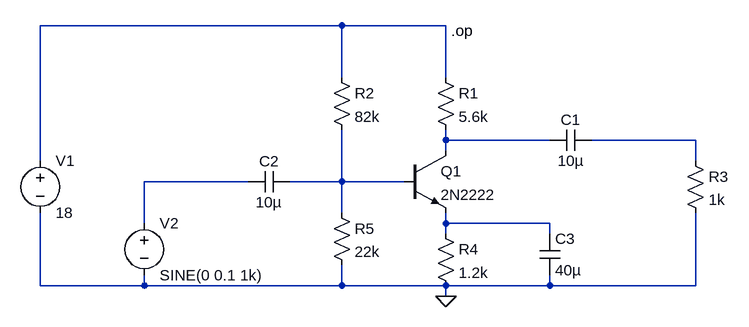
[diagram p0: schematic H3 - Examples LTSpice - 2.asc]
H3 - Examples LTSpice - 2.asc, the LTspice schematic file:
Version 4
SHEET 1 984 680
WIRE 384 32 -80 32
WIRE 544 32 384 32
WIRE 384 112 384 32
WIRE 544 112 544 32
WIRE 544 208 544 192
WIRE 704 208 544 208
WIRE 928 208 768 208
WIRE 544 224 544 208
WIRE -80 240 -80 32
WIRE 928 240 928 208
WIRE 240 272 80 272
WIRE 384 272 384 192
WIRE 384 272 304 272
WIRE 480 272 384 272
WIRE 384 320 384 272
WIRE 80 336 80 272
WIRE 544 336 544 320
WIRE 704 336 544 336
WIRE 544 352 544 336
WIRE 704 352 704 336
WIRE -80 432 -80 320
WIRE 80 432 80 416
WIRE 80 432 -80 432
WIRE 384 432 384 400
WIRE 384 432 80 432
WIRE 544 432 384 432
WIRE 704 432 704 416
WIRE 704 432 544 432
WIRE 928 432 928 320
WIRE 928 432 704 432
WIRE 544 448 544 432
FLAG 544 448 0
DATAFLAG 544 208 ""
DATAFLAG 384 272 ""
DATAFLAG 544 336 ""
SYMBOL voltage -80 224 R0
WINDOW 123 0 0 Left 0
WINDOW 39 0 0 Left 0
SYMATTR InstName V1
SYMATTR Value 18
SYMBOL voltage 80 320 R0
WINDOW 123 0 0 Left 0
WINDOW 39 0 0 Left 0
SYMATTR InstName V2
SYMATTR Value SINE(0 0.1 1k)
SYMBOL npn 480 224 R0
SYMATTR InstName Q1
SYMATTR Value 2N2222
SYMBOL res 912 224 R0
SYMATTR InstName R3
SYMATTR Value 1k
SYMBOL res 528 96 R0
SYMATTR InstName R1
SYMATTR Value 5.6k
SYMBOL res 368 96 R0
SYMATTR InstName R2
SYMATTR Value 82k
SYMBOL cap 768 192 R90
WINDOW 0 0 32 VBottom 2
WINDOW 3 32 32 VTop 2
SYMATTR InstName C1
SYMATTR Value 10µ
SYMBOL cap 304 256 R90
WINDOW 0 0 32 VBottom 2
WINDOW 3 32 32 VTop 2
SYMATTR InstName C2
SYMATTR Value 10µ
SYMBOL res 528 336 R0
SYMATTR InstName R4
SYMATTR Value 1.2k
SYMBOL cap 688 352 R0
SYMATTR InstName C3
SYMATTR Value 40µ
SYMBOL res 368 304 R0
SYMATTR InstName R5
SYMATTR Value 22k
TEXT 552 40 Left 2 !.op

The netlist it stands for:
* H3 - Examples LTSpice - 2.asc
V1 N001 0 18
V2 N004 0 SINE(0 0.1 1k)
Q1 N002 N005 N006 0 2N2222
R3 N003 0 1k
R1 N001 N002 5.6k
R2 N001 N005 82k
C1 N003 N002 10µ
C2 N005 N004 10µ
R4 N006 0 1.2k
C3 N006 0 40µ
R5 N005 0 22k
.model NPN NPN
.model PNP PNP
.lib standard.bjt
.op
.backanno
.end